# EAGLE schematic X15_Power_Plate (EAGLE 9.6.2)
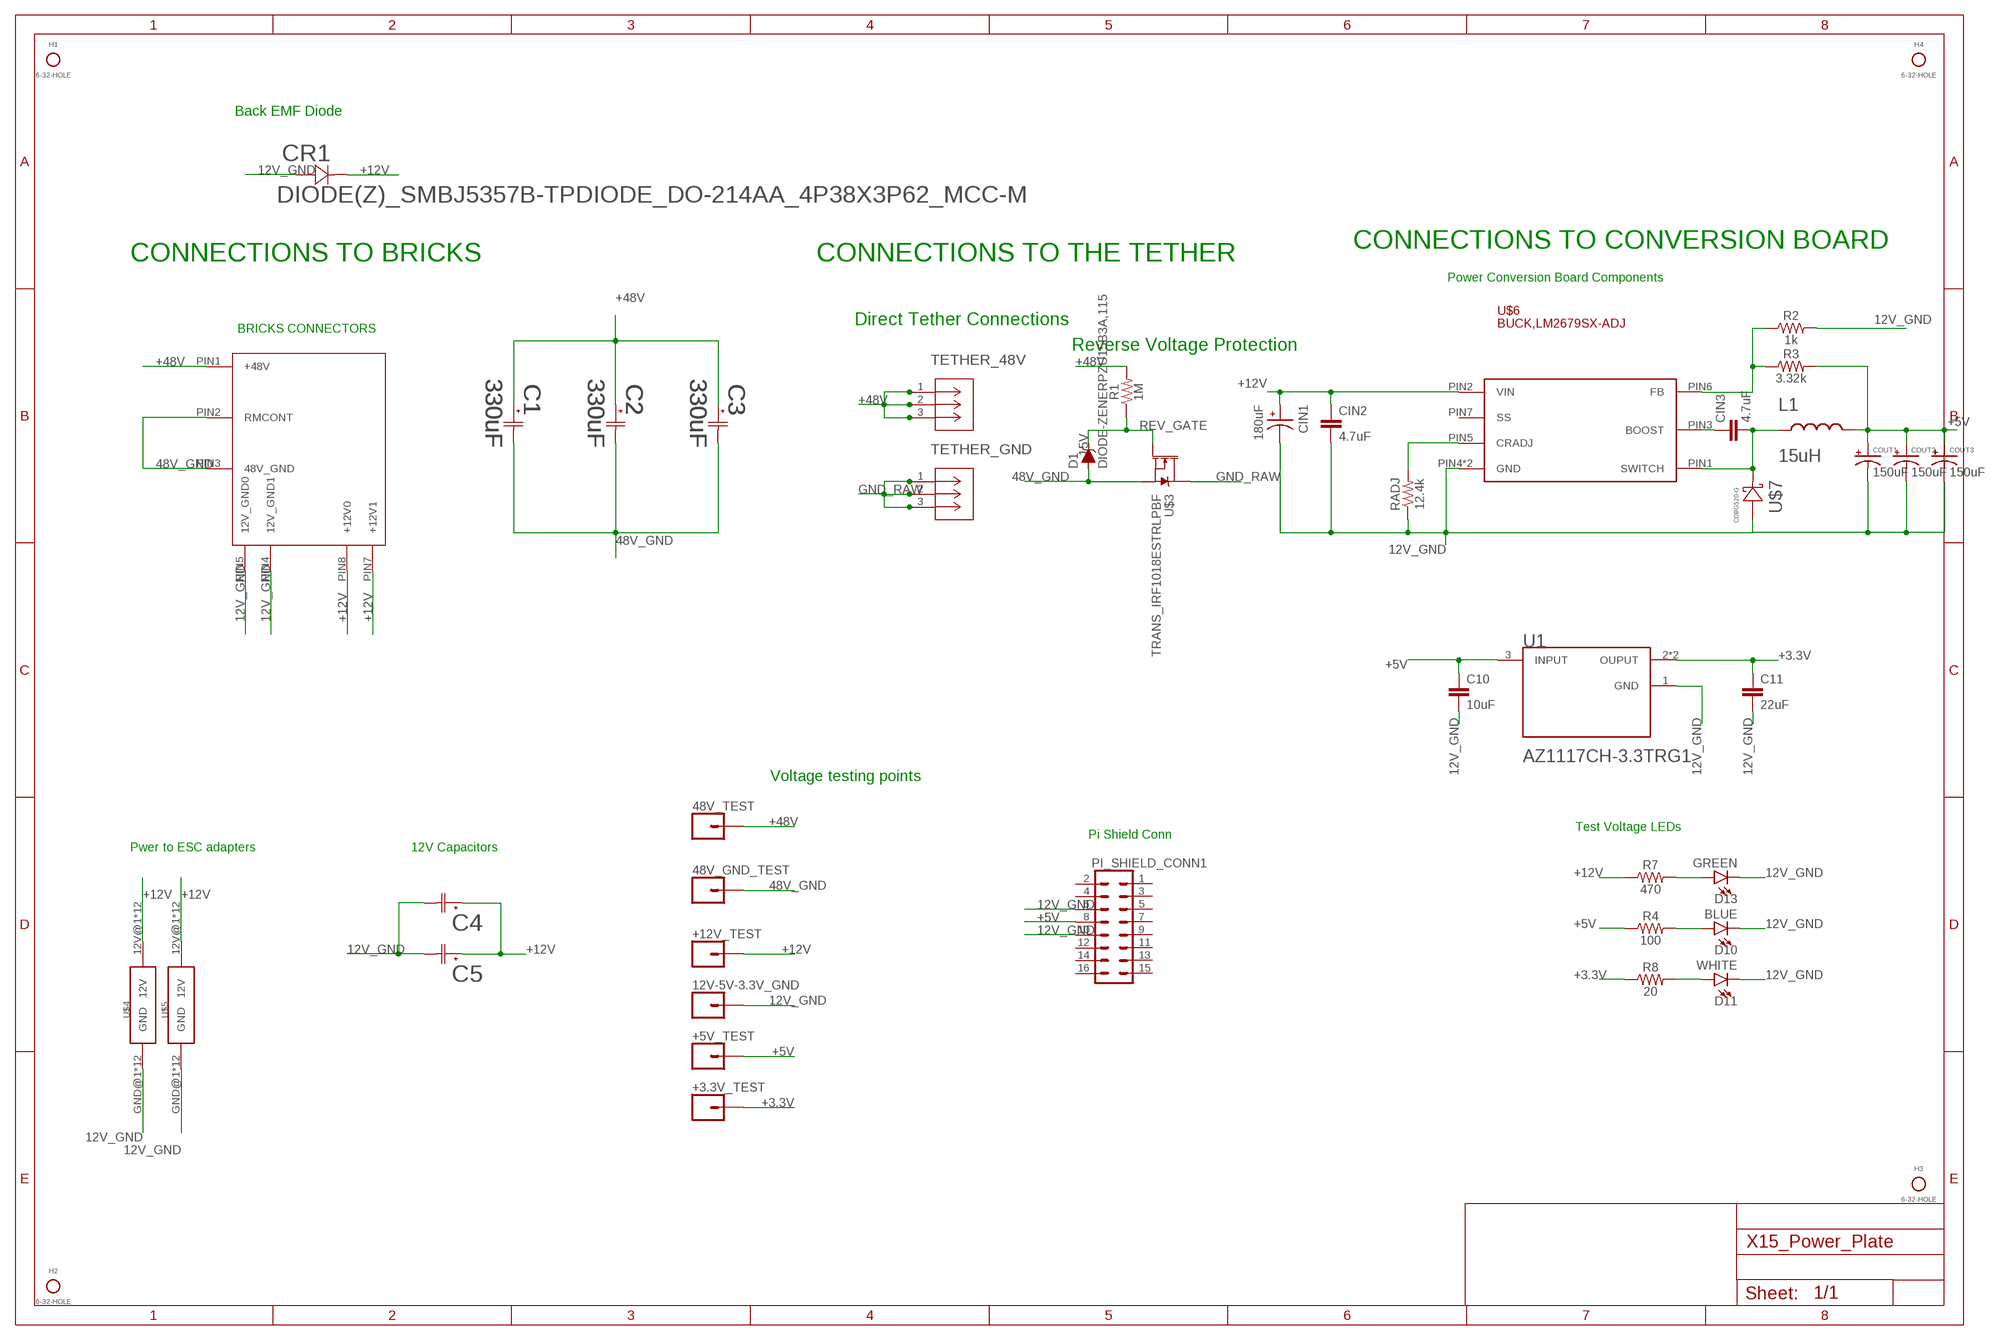
[diagram p0: schematic, sheet 1]

## Parts
12V-5V-3.3V_GND  CONN_01  [1X01]
48V_GND_TEST  CONN_01  [1X01]
48V_TEST  CONN_01  [1X01]
+3.3V_TEST  CONN_01  [1X01]
+5V_TEST  CONN_01  [1X01]
+12V_TEST  CONN_01  [1X01]
C1  330uF  CAP_MAL215099112E3CAP_099112E3_VIS-M  [CAP_099112E3_VIS-M]
C2  330uF  CAP_MAL215099112E3CAP_099112E3_VIS-M  [CAP_099112E3_VIS-M]
C3  330uF  CAP_MAL215099112E3CAP_099112E3_VIS-M  [CAP_099112E3_VIS-M]
C4  UCV1E561MNL1GSCAP_UCD_8X10_NCH  [CAP_UCD_8X10_NCH]
C5  UCV1E561MNL1GSCAP_UCD_8X10_NCH  [CAP_UCD_8X10_NCH]
C10  10uF  4.7PF-0603-50V-5%  [0603]
C11  22uF  4.7PF-0603-50V-5%  [0603]
CIN1  180uF  EEEFKE181XSP  [CAP_EEEFKE181XSP]
CIN2  4.7uF  4.7UF0603  [0603]
CIN3  4.7uF  4.7UF0603  [0603]
COUT1  150uF  C-TANTALUM(10UF_150UF)  [2917(7343-31-METRIC)]
COUT2  150uF  C-TANTALUM(10UF_150UF)  [2917(7343-31-METRIC)]
COUT3  150uF  C-TANTALUM(10UF_150UF)  [2917(7343-31-METRIC)]
CR1  DIODE(Z)_SMBJ5357B-TPDIODE_DO-214AA_4P38X3P62_MCC-M  [DIODE_DO-214AA_4P38X3P62_MCC-M]
D1  DIODE-ZENERPZU15B3A,115  [SOD-323]
D10  BLUE  LED-BLUE0603  [LED-0603]
D11  WHITE  LED-WHITE0603  [LED-0603]
D13  GREEN  LED-GREEN0603  [LED-0603]
H1  6-32-HOLE  [6-32-HOLE]
H2  6-32-HOLE  [6-32-HOLE]
H3  6-32-HOLE  [6-32-HOLE]
H4  6-32-HOLE  [6-32-HOLE]
L1  15uH  HCMA1305  [HCMA1305]
PI_SHIELD_CONN1  8X_CONN  [IPL7X2]
R1  1M  1MOHM-0603-1/4W-5%  [0603]
R2  1k  2.0KOHM-0603-1/10W-5%  [0603]
R3  3.32k  2.0KOHM-0603-1/10W-5%  [0603]
R4  100  100OHM-0603-1/4W-5%  [0603]
R7  470  470OHM-0603-1/10W-1%  [0603]
R8  20  20OHM-0603-1/10W-1%  [0603]
RADJ  12.4k  2.0KOHM-0603-1/10W-5%  [0603]
TETHER_48V  796636-3(TETHER)  [CON3_P5MM_VER_TERM-BLK_TYC]
TETHER_GND  796636-3(TETHER)  [CON3_P5MM_VER_TERM-BLK_TYC]
U1  LINEAR,AZ1117CR-3.3TRG1DIODES_AZ1117CH-3.3TRG1_0_0  [LINEAR,AZ1117CR-3.3TRG1]
U$2  CONN_BMR480_CONNECTOR  [BMR480_CONNECTOR]
U$3  TRANS_IRF1018ESTRLPBF  TRANS_IRF1018EPBF  [D2PAK]
U$4  BACKPLANE_ESC_ADAPTER_PWRBKP  [BACKPLANE_ESC_ADAPTER_BKP_PWR]
U$5  BACKPLANE_ESC_ADAPTER_PWRBKP  [BACKPLANE_ESC_ADAPTER_BKP_PWR]
U$6  BUCK,LM2679SX-ADJ  [BUCK,LM2679SX-ADJ]
U$7  CDBG520-G  [DO214AC]

## Nets
12V_GND: 12V-5V-3.3V_GND.1 C4.2 C5.2 C10.2 C11.2 CIN1.2 CIN2.2 COUT1.- COUT2.- COUT3.- CR1.2 D10.C D11.C D13.C PI_SHIELD_CONN1.6 PI_SHIELD_CONN1.10 R2.2 RADJ.1 U1.1(GND) U$2.PIN4(12V_GND1) U$2.PIN5(12V_GND0) U$4.GND@1(GND) U$4.GND@2(GND) U$4.GND@3(GND) U$4.GND@4(GND) U$4.GND@5(GND) U$4.GND@6(GND) U$4.GND@7(GND) U$4.GND@8(GND) U$4.GND@9(GND) U$4.GND@10(GND) U$4.GND@11(GND) U$4.GND@12(GND) U$5.GND@1(GND) U$5.GND@2(GND) U$5.GND@3(GND) U$5.GND@4(GND) U$5.GND@5(GND) U$5.GND@6(GND) U$5.GND@7(GND) U$5.GND@8(GND) U$5.GND@9(GND) U$5.GND@10(GND) U$5.GND@11(GND) U$5.GND@12(GND) U$6.PIN4(GND) U$6.PIN8(GND) U$7.A
48V_GND: 48V_GND_TEST.1 C1.2 C2.2 C3.2 D1.A U$2.PIN2(RMCONT) U$2.PIN3(48V_GND) U$3.2(S)
+3.3V: +3.3V_TEST.1 C11.1 R8.1 U1.2(OUPUT) U1.4(OUPUT)
+5V: +5V_TEST.1 C10.1 COUT1.+ COUT2.+ COUT3.+ L1.2 PI_SHIELD_CONN1.8 R3.2 R4.1 U1.3(INPUT)
+12V: +12V_TEST.1 C4.1 C5.1 CIN1.1 CIN2.1 CR1.1 R7.1 U$2.PIN7(+12V1) U$2.PIN8(+12V0) U$4.12V@1(12V) U$4.12V@2(12V) U$4.12V@3(12V) U$4.12V@4(12V) U$4.12V@5(12V) U$4.12V@6(12V) U$4.12V@7(12V) U$4.12V@8(12V) U$4.12V@9(12V) U$4.12V@10(12V) U$4.12V@11(12V) U$4.12V@12(12V) U$5.12V@1(12V) U$5.12V@2(12V) U$5.12V@3(12V) U$5.12V@4(12V) U$5.12V@5(12V) U$5.12V@6(12V) U$5.12V@7(12V) U$5.12V@8(12V) U$5.12V@9(12V) U$5.12V@10(12V) U$5.12V@11(12V) U$5.12V@12(12V) U$6.PIN2(VIN)
+48V: 48V_TEST.1 C1.1 C2.1 C3.1 R1.2 TETHER_48V.1 TETHER_48V.2 TETHER_48V.3 U$2.PIN1(+48V)
GND_RAW: TETHER_GND.1 TETHER_GND.2 TETHER_GND.3 U$3.3(D)
N$2: R2.1 R3.1 U$6.PIN6(FB)
N$3: D13.A R7.2
N$4: CIN3.2 L1.1 U$6.PIN1(SWITCH) U$7.C
N$5: CIN3.1 U$6.PIN3(BOOST)
N$8: RADJ.2 U$6.PIN5(CRADJ)
N$9: D10.A R4.2
N$12: D11.A R8.2
REV_GATE: D1.C R1.1 U$3.1(G)
Unconnected: PI_SHIELD_CONN1.1 PI_SHIELD_CONN1.2 PI_SHIELD_CONN1.3 PI_SHIELD_CONN1.4 PI_SHIELD_CONN1.5 PI_SHIELD_CONN1.7 PI_SHIELD_CONN1.9 PI_SHIELD_CONN1.11 PI_SHIELD_CONN1.12 PI_SHIELD_CONN1.13 PI_SHIELD_CONN1.14 PI_SHIELD_CONN1.15 PI_SHIELD_CONN1.16 U$6.PIN7(SS)

## Notes on the sheet
- Back EMF Diode
- CONNECTIONS TO CONVERSION BOARD
- CONNECTIONS TO BRICKS | CONNECTIONS TO THE TETHER
- Power Conversion Board Components
- Direct Tether Connections
- BRICKS CONNECTORS
- Reverse Voltage Protection
- Voltage testing points
- Test Voltage LEDs
- Pi Shield Conn
- Pwer to ESC adapters | 12V Capacitors

## Library data of the parts
12V-5V-3.3V_GND 48V_GND_TEST 48V_TEST +3.3V_TEST +5V_TEST +12V_TEST = SparkFun-Connectors:CONN_01: Single connection point. Often used as Generic Header-pin footprint for 0.1 inch spaced/style header connections On any of the 0.1 inch spaced packages, you can populate with these: Break Away Headers - Straight <https://www.sparkfun.com/products/116> (PRT-00116) Break Away Male Headers - Right Angle <https://www.sparkfun.com/products/553> (PRT-00553) Female Headers <https://www.sparkfun.com/products/115> (PRT-00115) Break Away Headers - Machine Pin <https://www.sparkfun.com/products/117> (PRT-00117) Break Away Female Headers - Swiss Machine Pin <https://www.sparkfun.com/products/743> (PRT-00743) This device is also useful as a general connection point to wire up your design to another part of your project. Our various solder wires solder well into these plated through hole pads. Hook-Up Wire - Assortment (Stranded, 22 AWG) <https://www.sparkfun.com/products/11375> (PRT-11375) Hook-Up Wire - Assortment (Solid Core, 22 AWG) <https://www.sparkfun.com/products/11367> (PRT-11367) View the entire wire category on our website here <https://www.sparkfun.com/categories/141> Special notes: SMTSO-256-ET is a "flush mount" nut for a 4-40 screw. We mostly use this on specialty testbeds; it is a nice way to connect hardware to your PCB at an adjustable hieght. Also note, the SNAP packages are for using a snappable style connector. We sell a baggie of snaps and they are also used on two LilyPad designs: Snap Assortment - 30 pack (male and female) <https://www.sparkfun.com/products/11347> (DEV-11347) LilyPad Arduino SimpleSnap <https://www.sparkfun.com/products/10941> (DEV-10941) LilyPad SimpleSnap Protoboard <https://www.sparkfun.com/products/10940> (DEV-10940)
C1-C3 = X15_Brickstribution:CAP_MAL215099112E3; COPYRIGHT: Copyright (C) 2022 Ultra Librarian. All rights reserved.; MANUFACTURER_PART_NUMBER: MAL215099112E3; MFR_NAME: Vishay
C4 C5 = 2023-01-03_19-29-37_Library:UCV1E561MNL1GS; COPYRIGHT: Copyright (C) 2023 Ultra Librarian. All rights reserved.; DIGI-KEY_PART_NUMBER_1: 493-14353-1-ND; DIGI-KEY_PART_NUMBER_2: 493-14353-2-ND; DIGI-KEY_PART_NUMBER_3: 493-14353-6-ND; MANUFACTURER_PART_NUMBER: UCV1E561MNL1GS; MFR_NAME: Nichicon
C10 C11 = SparkFun-Capacitors:4.7PF: 4.7pF ceramic capacitors A capacitor is a passive two-terminal electrical component used to store electrical energy temporarily in an electric field.; PROD_ID: CAP-07880; VALUE: 4.7pF
CIN1 = X15-Conversion-Parts-Library:EEEFKE181XSP; DESCRIPTION: 180µF 25V Aluminum Electrolytic Capacitors Radial, Can - SMD 340mOhm @ 100kHz 2000 Hrs @ 105°C; DIGI-KEY_PART_NUMBER: P18956TR-ND; MF: Panasonic; MP: EEEFKE181XSP; PACKAGE: RADIAL-2 Panasonic
CIN2 CIN3 = SparkFun-Capacitors:4.7UF: 4.7µF ceramic capacitors A capacitor is a passive two-terminal electrical component used to store electrical energy temporarily in an electric field.; PROD_ID: CAP-08280
COUT1-COUT3 = X15-Conversion-Parts-Library:C-TANTALUM(10UF_150UF)
CR1 = X15_Brickstribution:DIODE(Z)_SMBJ5357B-TP; COPYRIGHT: Copyright (C) 2022 Ultra Librarian. All rights reserved.; MANUFACTURER_PART_NUMBER: SMBJ5357B-TP; MFR_NAME: MCC
D1 = SparkFun-DiscreteSemi:DIODE-ZENER: Zener Diode A Zener diode allows current to flow from its anode to its cathode like a normal semiconductor diode, but it also permits current to flow in the reverse direction when its "Zener voltage" is reached. - WIkipedia; ZENER_VOLTAGE: 15V
D10 = SparkFun-LED:LED-BLUE: Blue SMD LED Used in manufacturing of various products at SparkFun Packages: 0603 - SMD 0603 package [Product Link] <http://www.digikey.com/product-detail/en/SMLE12BC7TT86/511-1589-2-ND/1641808> 1206 - SMD1206 package [Product Link] <http://www.digikey.com/product-detail/en/lite-on-inc/LTST-C150TBKT/160-1643-1-ND/573584> SparkFun Products: ESP8266 Thing-Dev Board <https://www.sparkfun.com/products/13711> RedBoard <https://www.sparkfun.com/products/12757>; PROD_ID: DIO-08575
D11 = SparkFun-LED:LED-WHITE: White SMD LED Used in manufacturing several products at SparkFun. Packages: 0603 - Bright White SMD 0603 package[Product Link] <http://www.kingbrightusa.com/product.asp?catalog_name=LED&product_id=APT1608QWF/D> 1206 - Bright White SMD1206 package [Product Link] <http://www.kingbrightusa.com/product.asp?catalog_name=LED&product_id=APT3216QWF/D> 3014 - Super Bright SMD 3014 package [Datasheet] <http://www.lumileds.com/uploads/459/DS208-pdf> SparkFun Products: Blackberry Trackballer Breakout <https://www.sparkfun.com/products/13169> Digital SandBox <https://www.sparkfun.com/products/12651>; PROD_ID: DIO-09004
D13 = SparkFun-LED:LED-GREEN: Green SMD LED Used in manufacturing of various products at SparkFun Packages: 0603 - SMD 0603 package [Product Link] <http://www.futureelectronics.com/en/technologies/semiconductors/optoelectronics/leds/Pages/9894312-LTST-C190GKT.aspx?CrossPart=HSMG-C190&IM=0> LilyPad 1206 - SMD1206 LilyPad package [Product Link] <http://www.futureelectronics.com/en/Technologies/Product.aspx?ProductID=IN150NGHARVATEKCORPORATION2049943&IM=0> 1206 - SMD1206 package [Product Link] <http://www.futureelectronics.com/en/technologies/semiconductors/optoelectronics/leds/Pages/8315665-LTST-C150KGKT.aspx?IM=0> 1206 Bottom Mount -SMD 1206 Bottom Mount [Product Link] <http://www.digikey.com/product-detail/en/lite-on-inc/LTST-C230KGKT/160-1456-1-ND/386854> SparkFun Products: Pro Mini 328 -5V <https://www.sparkfun.com/products/821> RedBoard <https://www.sparkfun.com/products/12757> MP3 Trigger <https://www.sparkfun.com/products/13720> Makey Makey <https://www.sparkfun.com/products/11076>; PROD_ID: DIO-00821
H1-H4 = X15_Brickstribution:6-32-HOLE
L1 = X15-Conversion-Parts-Library:HCMA1305: Eaton HCMA1305-150-R Inductor
PI_SHIELD_CONN1 = X15-Backplane Parts:8X_CONN
R1 = SparkFun-Resistors:1MOHM: 1MΩ resistor A resistor is a passive two-terminal electrical component that implements electrical resistance as a circuit element. Resistors act to reduce current flow, and, at the same time, act to lower voltage levels within circuits. - Wikipedia; PROD_ID: RES-07868
R2 R3 RADJ = SparkFun-Resistors:2.0KOHM: 2kΩ resistor A resistor is a passive two-terminal electrical component that implements electrical resistance as a circuit element. Resistors act to reduce current flow, and, at the same time, act to lower voltage levels within circuits. - Wikipedia; PROD_ID: RES-08296; VALUE: 2.0k
R4 = SparkFun-Resistors:100OHM: 100Ω resistor A resistor is a passive two-terminal electrical component that implements electrical resistance as a circuit element. Resistors act to reduce current flow, and, at the same time, act to lower voltage levels within circuits. - Wikipedia; PROD_ID: RES-12438
R7 = SparkFun-Resistors:470OHM: 470Ω resistor A resistor is a passive two-terminal electrical component that implements electrical resistance as a circuit element. Resistors act to reduce current flow, and, at the same time, act to lower voltage levels within circuits. - Wikipedia; PROD_ID: RES-07869
R8 = SparkFun-Resistors:20OHM: RES-07862; PROD_ID: RES-07862
TETHER_48V TETHER_GND = X15_Brickstribution:796636-3(TETHER); COPYRIGHT: Copyright (C) 2022 Ultra Librarian. All rights reserved.; DIGI-KEY_PART_NUMBER_1: A98423-ND; MANUFACTURER_PART_NUMBER: 796636-3; MFR_NAME: TE Connectivity
U1 = X15-Conversion-Parts-Library:LINEAR,AZ1117CR-3.3TRG1: 1.35A 3.3V LDO Reg. Current Limit SOT223 Check availability <https://pricing.snapeda.com/parts/AZ1117CH-3.3TRG1/Diodes%20Inc./view-part?ref=eda>; AVAILABILITY: In Stock; DESCRIPTION: Linear Voltage Regulator IC Positive Fixed 1 Output 1A SOT-223-3; MF: Diodes Inc.; MP: AZ1117CH-3.3TRG1; PACKAGE: SOT-223 Diodes Inc.; PRICE: None; PURCHASE-URL: https://pricing.snapeda.com/search/part/AZ1117CH-3.3TRG1/?ref=eda
U$2 = X15_Brickstribution:CONN_BMR480_CONNECTOR
U$3 = X15_Brickstribution:TRANS_IRF1018EPBF
U$4 U$5 = X15-Backplane Parts:BACKPLANE_ESC_ADAPTER_PWR
U$6 = X15-Conversion-Parts-Library:BUCK,LM2679SX-ADJ
U$7 = X15-Conversion-Parts-Library:CDBG520-G